# EAGLE design MBus-ESP-01 (EAGLE 9.3.1)
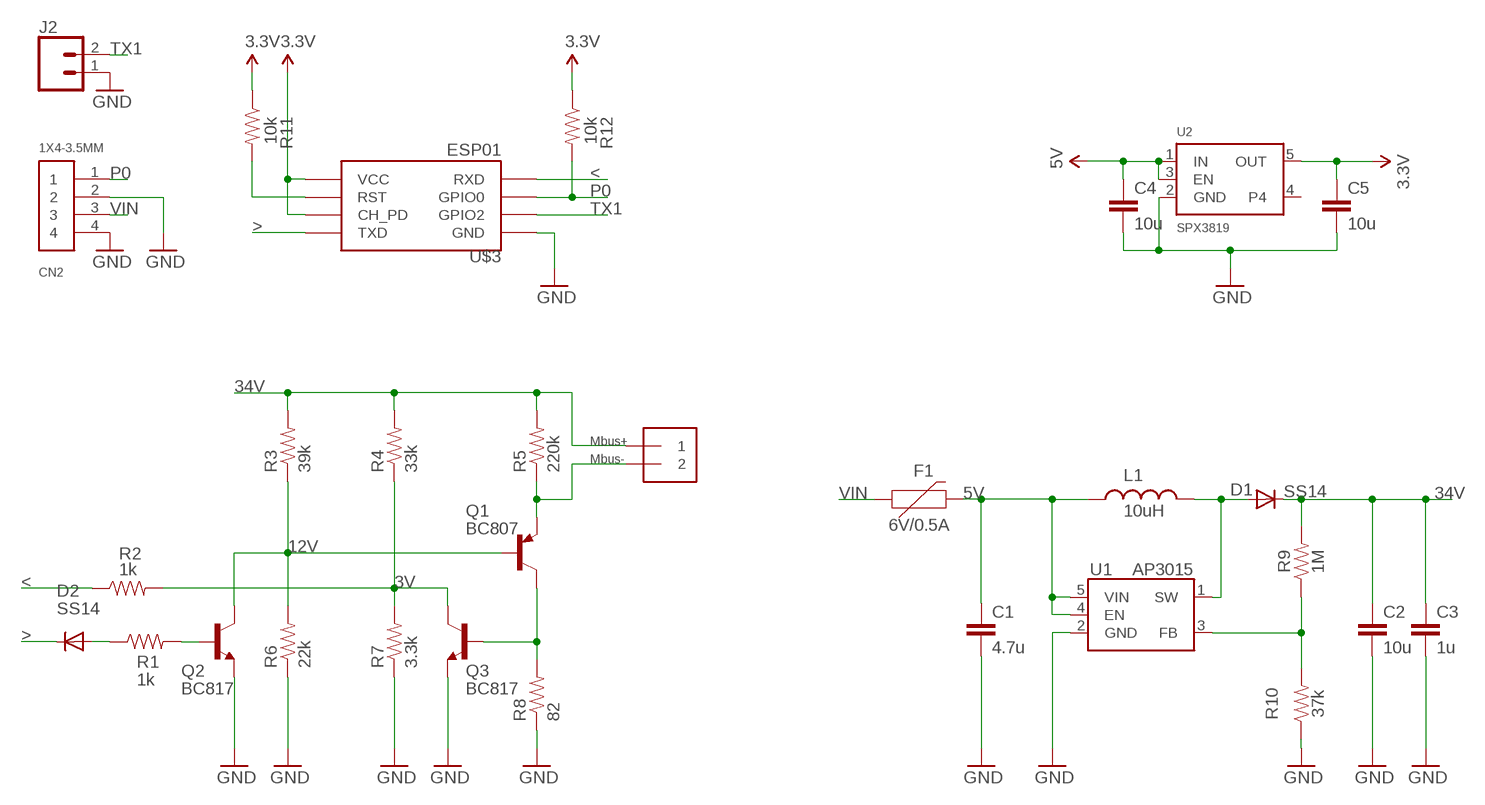
[diagram p0: schematic, sheet 1]

## Parts
C1  4.7u  1.0UF-0805-25V-(+80/-20%)  [0805]
C2  10u  1.0UF-1206-50V-10%  [1206]
C3  1u  1.0UF-1206-50V-10%  [1206]
C4  10u  CAP0603-CAP  [0603-CAP]
C5  10u  CAP0603-CAP  [0603-CAP]
CN2  1X4-3.5MM  [1X04-3.5MM]
D1  SS14  DIODESOD-123  [SOD-123]
D2  SS14  DIODESOD-123  [SOD-123]
F1  6V/0.5A  PPTC_HALF-AMP  [1206]
J1  1X2-3.5MM  [1X2-3.5MM]
J2  CONN_021X02_NO_SILK  [1X02_NO_SILK]
L1  10uH  INDUCTOR-B82462G  [B82462G]
Q1  BC807  BC807-16-PNP-SOT23-BEC  [SOT23-BEC]
Q2  BC817  BC817-16SMD  [SOT23-BEC]
Q3  BC817  BC817-16SMD  [SOT23-BEC]
R1  1k  RESISTOR0805  [0805]
R2  1k  RESISTOR0805  [0805]
R3  39k  RESISTOR0805  [0805]
R4  33k  RESISTOR0805  [0805]
R5  220k  RESISTOR1206  [1206]
R6  22k  RESISTOR0805  [0805]
R7  3.3k  RESISTOR0805  [0805]
R8  82  RESISTOR1206  [1206]
R9  1M  RESISTOR0805  [0805]
R10  37k  RESISTOR0805  [0805]
R11  10k  RESISTOR0805  [0805]
R12  10k  RESISTOR0805  [0805]
U1  AP3015  [SOT-23-5]
U2  SPX3819  VREG_SOT23-5  [SOT23-5]
U$3  ESP01  [ESP01]

## Nets
3.3V: C5.1 R11.1 R12.1 U2.5(OUT) U$3.CH_PD U$3.VCC
3V: Q3.C R2.2 R4.1 R7.2
5V: C1.1 C4.1 F1.2 L1.P$1 U1.4(EN) U1.5(VIN) U2.1(IN) U2.3(EN)
12V: Q1.B Q2.C R3.1 R6.2
34V: C2.1 C3.1 D1.C J1.1 R3.2 R4.2 R5.2 R9.2
<: R2.1 U$3.RX(RXD)
>: D2.C U$3.TX(TXD)
GND: C1.2 C2.2 C3.2 C4.2 C5.2 CN2.2 CN2.4 J2.1 Q2.E Q3.E R6.1 R7.1 R8.1 R10.1 U1.2(GND) U2.2(GND) U$3.GND
MBUS-: J1.2 Q1.E R5.1
N$3: Q1.C Q3.B R8.2
N$4: R9.1 R10.2 U1.3(FB)
N$5: D1.A L1.P$2 U1.1(SW)
N$6: D2.A R1.1
N$9: Q2.B R1.2
P0: CN2.1 R12.2 U$3.GPIO0
RST: R11.2 U$3.RST
TX1: J2.2 U$3.GPIO2
VIN: CN2.3 F1.1
Unconnected: U2.4

## Notes on the sheet
- Mbus+
- Mbus-

## Library data of the parts
C1 = SparkFun-Capacitors:1.0UF: 1µF ceramic capacitors A capacitor is a passive two-terminal electrical component used to store electrical energy temporarily in an electric field.; PROD_ID: CAP-11625; VALUE: 1.0uF
C2 C3 = SparkFun-Capacitors:1.0UF: 1µF ceramic capacitors A capacitor is a passive two-terminal electrical component used to store electrical energy temporarily in an electric field.; PROD_ID: CAP-09822; VALUE: 1.0uF
C4 C5 = SparkFun:CAP: Capacitor Standard 0603 ceramic capacitor, and 0.1" leaded capacitor.
CN2 = adafruit:1X4: 4-pin connector
D1 D2 = adafruit:DIODE: Diode SMADIODE - SMA Surface Mount Package 20V 1A Schottky Diode Digikey: 641-1014-6-ND DO-1N4148 - Through Hole Small Current Diode SOD-123 20V 1 A (.5mV Vf) Schottky Diode - Digikey: MBRX120TPMSCT-ND SOD-323 10V 570mA (.38mV Vf, 3ns) Schottky Diode - Digikey: ZLLS410CT-ND SOD-523 30V 30mA Schottky Diode (RB751S-40TE61) - Digikey: RB751S-40TE61CT-ND SOT23-R/W - SOT23 Package (R = Solder Paste/Reflow Ovens, W = Hand-Soldering) BAT54Film 40V 300mA - Digikey: 497-7162-1-ND
F1 = SparkFun-Fuses:PPTC: Resettable Fuse PPTC Resettable Fuse. Really a sort of resistor with a polymeric positive temperature coefficient whose resistance increases dramatically with an increase in temperature. When heated by the power passing through the resistance rises causing the current to be limited, protecting the circuit. This is achieved by the transition of the polymer from a crystalline to an amorphous state where the conductive carbon separates breaking the conductive pathways found in the cool crystalline structure. When a PPTC cools back down it resumes conducting letting the circuit turn back on. SparkFun Products: SparkFun RedBoard - Programmed with Arduino <https://www.sparkfun.com/products/12757> Pro Micro - 5V/16MHz <https://www.sparkfun.com/products/12640> Arduino Pro 328 - 5V/16MHz <https://www.sparkfun.com/products/10915> MP3 Trigger <https://www.sparkfun.com/products/13720>; PROD_ID: RES-08585
J1 = adafruit:1X2: 3.5mm Terminal block http://www.ladyada.net/library/pcb/eaglelibrary.html
J2 = SparkFun-Connectors:CONN_02: Multi connection point. Often used as Generic Header-pin footprint for 0.1 inch spaced/style header connections On any of the 0.1 inch spaced packages, you can populate with these: Break Away Headers - Straight <https://www.sparkfun.com/products/116> (PRT-00116) Break Away Male Headers - Right Angle <https://www.sparkfun.com/products/553> (PRT-00553) Female Headers <https://www.sparkfun.com/products/115> (PRT-00115) Break Away Headers - Machine Pin <https://www.sparkfun.com/products/117> (PRT-00117) Break Away Female Headers - Swiss Machine Pin <https://www.sparkfun.com/products/743> (PRT-00743) For SCREWTERMINALS and SPRING TERMINALS visit here: Screw Terimnals on SparkFun.com <https://www.sparkfun.com/search/results?term=Screw+Terminals> (5mm/3.5mm/2.54mm spacing) This device is also useful as a general connection point to wire up your design to another part of your project. Our various solder wires solder well into these plated through hole pads. Hook-Up Wire - Assortment (Stranded, 22 AWG) <https://www.sparkfun.com/products/11375> (PRT-11375) Hook-Up Wire - Assortment (Solid Core, 22 AWG) <https://www.sparkfun.com/products/11367> (PRT-11367) View the entire wire category on our website here <https://www.sparkfun.com/categories/141> Special notes: Molex polarized connector foot print use with: PRT-08233 with associated crimp pins and housings. 2.54_SCREWTERM for use with PRT-10571. 3.5mm Screw Terminal footprints for PRT-08084 5mm Screw Terminal footprints for use with PRT-08432
L1 = SparkFun:INDUCTOR: Inductors Basic Inductor/Choke - 0603 and 1206. Footprints are not proven and vary greatly between part numbers.
Q1 = transistor:*-PNP-: PNP Transistror
Q2 Q3 = transistor-npn:BC817*: NPN Transistor
R1-R12 = SparkFun-Resistors:RESISTOR: Generic Resistor Package
U1 = dword1511-pmic-dcdc:AP3015: Micro-power Step-up DC-DC Converter
U2 = microbuilder:VREG_SOT23-5: SOT23-5 Fixed Voltage Regulators Part Current Out V Out V In V Dropout θJA (°C/W) TJ (°C) Digikey Part No. ADP121 150mA 3.3V 3.4-5.5V 0.09V @ 150mA -- -- ADP121-AUJZ33R7CT-ND ADP121 150mA 3.0V 3.1-5.5V 0.09V @ 150mA -- -- ADP121-AUJZ30R7CT-ND ADP122 300mA 3.3V 3.4-5.5V 0.085V @ 300mA -- -- ADP122AUJZ-3.3-R7CT-ND ADP1712 300mA 3.3V 3.5-5.5V 0.17V @ 300mA -- -- ADP1712AUJZ-3.3-R7TR-ND AP7311 (Low Cost) 150mA 3.3V 3.5-6V 0.15V @ 150mA -- -- AP7311-33WG-7DICT-ND LD39015M18R 150mA 1.8V 1.9V-5.5V 0.08V @ 100mA -- -- 497-6977-1-ND LP2985A-33DBVR 150mA 3.3V 3.3-16V 0.28V @ 150mA 206 150 296-18479-1-ND MCP1824T-3302E/OT 300mA 3.3V 3.5V-6V 0.2V @ 300mA -- -- MCP1824T-3302E/OTCT-ND MIC5205-2.5YM5 TR 150mA 2.5V 2.7-16V 0.165V @ 150mA -- -- 576-1257-2-ND MIC5205-3.0YM5 TR 150mA 3.0V 3.2V-16V 0.165V @ 150mA -- -- 576-1258-2-ND MIC5205-3.3YM5 TR 150mA 3.3V 3.5V-16V 0.165V @ 150mA -- -- 576-1259-2-ND TPS780330220 150mA 3.3V+2.2V 3.6-5.5V 250mV Max -- -- 296-23332-1-ND TDA3663/N1,135 100mA 3.3V 3.5-45V 0.18V @ 50mA -- -- 568-5343-1-ND Max operating temp can be calculated using θJA, TJ (max junction temperature), and power in watts. Set the "Maximum Ambient Temperature" until it reaches TJ ("Max Junction Temperature"), which is the absolute limit for safe use of the regulator: Heat Sink Temperature Calculator <http://www.daycounter.com/Calculators/Heat-Sink-Temperature-Calculator.phtml> For example, With 12V source into a 3.3V LP2985 and a 30mA load, we are dissipating (12V-3.3V) * 0.03A = 0.261W. With a θJA of 206 °C/W, a TJ of 150°C, and 261mW we can safely use the chip without a heat sink up to 75°C (=147.1°C Junction Temperature).
U$3 = esp8266modules:ESP01: ESP8266 Wifi module 01

## Board
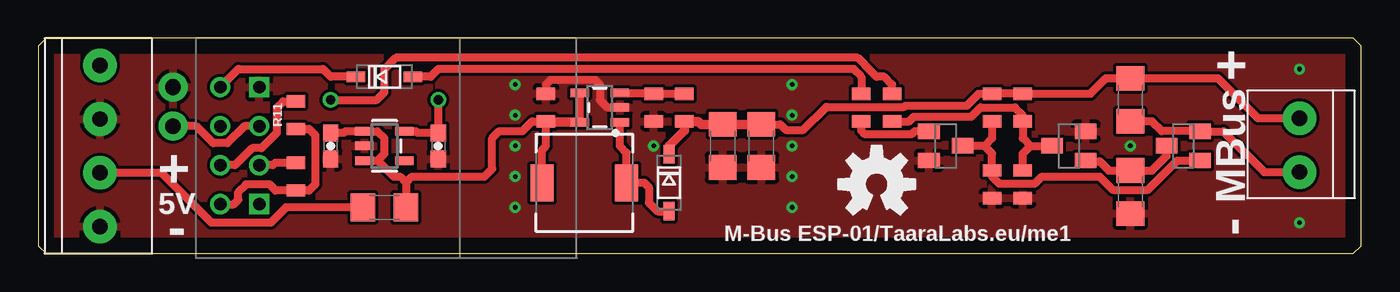
[diagram p1: board, top side]
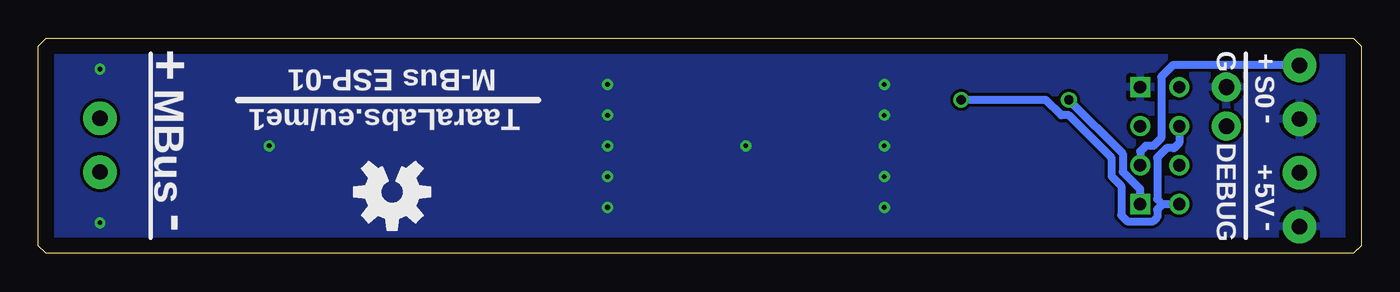
[diagram p2: board, bottom side, seen from below]

Size 86 x 14 mm. Coordinates in mm from the lower left corner, seen from the top.
Outline: 0,13.5 0,0.5 0.5,0 85.5,0 86,0.5 86,13.5 85.5,14 0.5,14 0,13.5
Copper layers (1*16): Top 0.035mm / dielectric 1.5mm / Bottom 0.035mm
Design rules "default": minimum track width 10mil, minimum drill 24mil, track to track 8mil, track to pad 8mil, pad to pad 8mil, via to via 8mil, smd to smd 8mil, copper to edge 40mil, drill to drill 8mil, minimum pad ring 10mil, minimum via ring 8mil, stop-mask expansion 4mil, vias tented up to drill 0mil, thermal gap 10mil

### Footprints (pad centres in the part's own frame; a part is rotated, then mirrored left to right if it is on the bottom)
0805 = smd 0.8 x 1.2: 1 -0.9,0; 2 0.9,0
1206 = smd 1.6 x 1.8: 1 -1.4,0; 2 1.4,0
0603-CAP = smd 1.1 x 1: 1 -0.85,0; 2 0.85,0
1X04-3.5MM = drill 1 pad 2.184: 1 -5.25,0; 2 -1.75,0; 3 1.75,0; 4 5.25,0
SOD-123 = smd 1.2 x 0.7: A 1.85,0; C -1.85,0
1X2-3.5MM = drill 1 pad 2.184: 1 1.8,0; 2 -1.7,0
1X02_NO_SILK = drill 1.016 pad 1.88: 1 0,0; 2 2.54,0
B82462G = smd 2.4 x 1.5: P$1 0,2.75; P$2 0,-2.75
SOT23-BEC = smd 1 x 1.4: B -0.95,-1.1; C 0,1.1; E 0.95,-1.1
SOT-23-5 = smd 0.55 x 1.2: 1 -0.95,-1.3; 2 0,-1.3; 3 0.95,-1.3; 4 0.95,1.3; 5 -0.95,1.3
SOT23-5 = smd 0.55 x 1.2: 1 -0.95,-1.3; 2 0,-1.3; 3 0.95,-1.3; 4 0.95,1.3; 5 -0.95,1.3
ESP01 = drill 0.8: CH_PD -1.285,-8.178; GPIO0 1.255,-5.638; GPIO2 -1.285,-5.638; RST 1.255,-8.178; TX -3.825,-8.178; VCC 3.795,-8.178 | drill 0.8 square: GND -3.825,-5.638; RX 3.795,-5.638

### Placement (x,y rotation side)
C1  33,9.5 90 top
C2  44.5,7 270 top
C3  47,7 270 top
C4  19,7 270 top
C5  26,7 270 top
CN2  4,7 270 top
D1  41,4.6 270 top
D2  22.5,11.5 0 top
F1  22.5,3 0 top
J1  82,7 90 top
J2  8.75,10.82 270 top
L1  35.5,4.6 90 top
Q1  74.44,7 90 top
Q2  59,7 270 top
Q3  67,7 90 top
R1  53.5,9.5 270 top
R2  55.5,9.5 270 top
R3  62,9.5 90 top
R4  64,9.5 90 top
R5  71,10 90 top
R6  62,4.5 90 top
R7  64,4.5 90 top
R8  71,4 90 top
R9  42,9.5 270 top
R10  40,9.5 90 top
R11  16.75,9 90 top
R12  16.75,5 90 top
U1  36.5,9.5 90 top
U2  22.5,7 270 top
U$1  [OSHW-LOGO-M]  54.5,4.5 0 top
U$2  [OSHW-LOGO-M]  63,4 180 bottom
U$3  20,7 270 top

### Tracks (layer width: path | path; a pad name or v marks a point on that pad's centre or on a via)
3.3V  (via drill 0.61)
  Top 0.508: v26,10 C5.1 24.65,7.85 24.55,7.95 U2.5 | U$3.VCC 12.71,3.21 13,3.5 13,4 13.5,4.5 15.02,4.5 15.42,4.1 R12.1 17.6,4.1 18,4.5 18,7.7 17.6,8.1 R11.1
  Bottom 0.508: U$3.CH_PD 11.82,7.18 12.14,6.86 12.64,6.86 13.25,6.24 13.25,3.55 12.91,3.21 | U$3.VCC 12.91,3.21 | 12.91,3.21 13.25,2.86 13.25,2.36 13.52,2.09 15.21,2.09 15.6,2.48 15.6,4.4 16.21,5.02 16.21,6.21 19,9 19.5,9 20.5,10 v26,10
3V
  Top 0.508: 64.5,7 64,7.5 R4.1 64,9 63.5,9.5 61.25,9.5 60.66,8.91 56.91,8.91 56.61,8.6 R2.2 | 64.5,7 Q3.C | R7.2 64,6.5 64.5,7
5V
  Top 0.508: U1.4 U1.5 | U2.3 22.05,6.05 | 22.05,6.05 22.5,6.5 22.5,7.5 22.05,7.95 U2.1 19.95,7.95 19.85,7.85 C4.1 | 22.05,6.05 23.1,5 23.5,5 23.9,4.6 | 23.9,4.6 24.3,5 29,5 29.5,5.5 29.5,7.5 29.96,7.96 31.46,7.96 32.1,8.6 C1.1 33,7 32.75,6.75 L1.P$1 | 23.9,4.6 F1.2
  Top 0.61: C1.1 33.05,8.55 U1.5
12V
  Top 0.508: R3.1 62,7.5 61.5,7 | 61.5,7 Q2.C | 61.5,7 62,6.5 R6.2 62,5 62.46,4.54 64.79,4.54 65.25,5 68.99,5 69.85,4.14 72.15,4.14 74.05,6.04 Q1.B
34V
  Top 0.508: J1.1 79.3,8.8 76.7,11.4 R5.2 69.4,11.4 68.4,10.4 R4.2 R3.2 61.15,10.4 60.37,9.62 56.37,9.62 56.29,9.54 51.23,9.54 49.72,8.04 48.6,8.04 48.23,8.4 C3.1
  Top 0.61: D1.C 41,7 42,8 R9.2 42.9,8.6 43.1,8.4 C2.1 C3.1
<  (via drill 0.61)
  Top 0.508: R2.1 55.5,11 55,11.5 54.5,11.5 54.21,11.79 53.28,12.73 23.23,12.73 22.5,12 22.5,10.5 22,10 v19,10
  Bottom 0.508: U$3.RX 14.36,4.17 15.5,5.31 15.5,6.5 v19,10
>
  Top 0.508: D2.C 19,11.5 18.5,12 13,12 U$3.TX
GND  (via drill 0.3)
  Top 0.508: U1.2 37,9.5 36.5,10 36.5,11 36.21,11.29 33.29,11.29 33,11 C1.2
  other vias: 31,11 31,9 31,7 31,5 31,3 49,11 40,7 49,9 49,7 49,5 49,3 82,2 71,7 82,12
  pour Top: 0,14 86,14 86,0 0,0
  pour Top: 0,0 0,14 86,14 86,0
  pour Bottom: 0,14 86,14 86,0 0,0
MBUS-
  Top 0.508: J1.2 79.7,5.3 77.05,7.95 Q1.E 73.04,7.96 72.4,8.6 R5.1
N$3
  Top 0.508: Q3.B 68.15,6 69,6 69.6,5.4 R8.2 72.4,5.4 73.34,6.34 Q1.C
N$4
  Top 0.508: U1.3 39.9,10.45 R10.2 R9.1
N$5
  Top 0.508: U1.1 37.8,7 38.25,6.55 L1.P$2 39.4,4.6 39.7,4.3 39.7,3.3 40.25,2.75 D1.A
N$6
  Top 0.508: R1.1 53.5,11.5 53,12 26,12 25.5,11.5 D2.A
N$9
  Top 0.508: Q2.B 56.96,7.95 56.75,7.74 53.76,7.74 53.5,8 R1.2
P0
  Top 0.508: U$3.GPIO0 15.24,5.75 15.4,5.9 R12.2
  Bottom 0.508: CN2.1 12.25,12.25 13,11.5 13,7.5 13.5,7 14,7 14.36,6.64 U$3.GPIO0
RST
  Top 0.508: R11.2 15.9,9.9 15.5,9.5 15.5,7.85 14.82,7.17 14.51,6.86 13.9,6.86 12.79,5.75 U$3.RST
TX1
  Top 0.508: U$3.GPIO2 13.39,8.29 12.28,7.17 11.36,7.17 10.25,8.29 J2.2
VIN
  Top 0.508: CN2.3 8,5.25 11.25,2 15.1,2 16.1,3 F1.1

### Text on the board
tNames: + | MBus | + | 5V | - | - | M-Bus ESP-01/TaaraLabs.eu/me1
bNames: + | G | M-Bus ESP-01 | + | S0 | - | TaaraLabs.eu/me1 | MBus | + | 5V | DEBUG | - | -